# Altium schematic sheet REDLED.SchDoc
size A
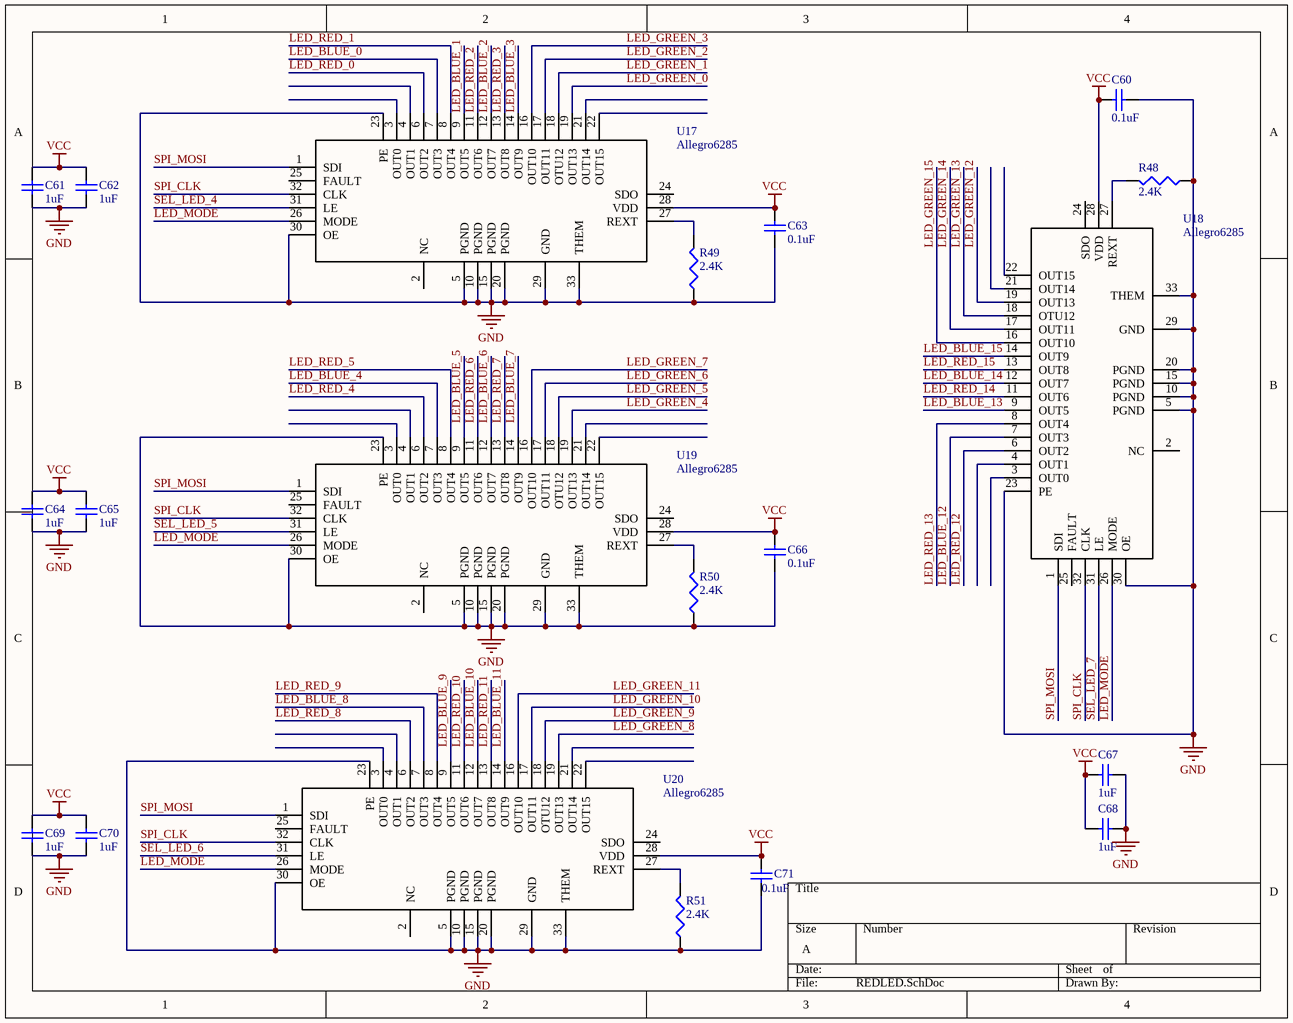
[diagram p0: REDLED.SchDoc]

## Parts
C60  value 0.1uF  [CAPC1005L]  (hidden comment: Cap Semi)
C61  value 1uF  [CAPC1608L]  (hidden comment: Cap Semi)
C62  value 1uF  [CAPC1608L]  (hidden comment: Cap Semi)
C63  value 0.1uF  [CAPC1005L]  (hidden comment: Cap Semi)
C64  value 1uF  [CAPC1608L]  (hidden comment: Cap Semi)
C65  value 1uF  [CAPC1608L]  (hidden comment: Cap Semi)
C66  value 0.1uF  [CAPC1005L]  (hidden comment: Cap Semi)
C67  value 1uF  [CAPC1608L]  (hidden comment: Cap Semi)
C68  value 1uF  [CAPC1608L]  (hidden comment: Cap Semi)
C69  value 1uF  [CAPC1608L]  (hidden comment: Cap Semi)
C70  value 1uF  [CAPC1608L]  (hidden comment: Cap Semi)
C71  value 0.1uF  [CAPC1005L]  (hidden comment: Cap Semi)
R48  value 2.4K  [RESC1608L]  (hidden comment: Res3)
R49  value 2.4K  [RESC1608L]  (hidden comment: Res3)
R50  value 2.4K  [RESC1608L]  (hidden comment: Res3)
R51  value 2.4K  [RESC1608L]  (hidden comment: Res3)
U17  Allegro6285  [QFN-32]
U18  Allegro6285  [QFN-32]
U19  Allegro6285  [QFN-32]
U20  Allegro6285  [QFN-32]

## Nets
GND: C60.1 C61.1 C62.1 C63.1 C64.1 C65.1 C66.1 C67.1 C68.1 C69.1 C70.1 C71.1 R48.1 R49.1 R50.1 R51.1 U17.5(PGND) U17.10(PGND) U17.15(PGND) U17.20(PGND) U17.23(PE) U17.29(GND) U17.30(OE) U17.33(THEM) U18.5(PGND) U18.10(PGND) U18.15(PGND) U18.20(PGND) U18.23(PE) U18.29(GND) U18.30(OE) U18.33(THEM) U19.5(PGND) U19.10(PGND) U19.15(PGND) U19.20(PGND) U19.23(PE) U19.29(GND) U19.30(OE) U19.33(THEM) U20.5(PGND) U20.10(PGND) U20.15(PGND) U20.20(PGND) U20.23(PE) U20.29(GND) U20.30(OE) U20.33(THEM)
VCC: C60.2 C61.2 C62.2 C63.2 C64.2 C65.2 C66.2 C67.2 C68.2 C69.2 C70.2 C71.2 U17.28(VDD) U18.28(VDD) U19.28(VDD) U20.28(VDD)
LED_BLUE_0: U17.7(OUT3)
LED_BLUE_1: U17.9(OUT5)
LED_BLUE_2: U17.12(OUT7)
LED_BLUE_3: U17.14(OUT9)
LED_BLUE_4: U19.7(OUT3)
LED_BLUE_5: U19.9(OUT5)
LED_BLUE_6: U19.12(OUT7)
LED_BLUE_7: U19.14(OUT9)
LED_BLUE_8: U20.7(OUT3)
LED_BLUE_9: U20.9(OUT5)
LED_BLUE_10: U20.12(OUT7)
LED_BLUE_11: U20.14(OUT9)
LED_BLUE_12: U18.7(OUT3)
LED_BLUE_13: U18.9(OUT5)
LED_BLUE_14: U18.12(OUT7)
LED_BLUE_15: U18.14(OUT9)
LED_GREEN_0: U17.19(OUT13)
LED_GREEN_1: U17.18(OTU12)
LED_GREEN_2: U17.17(OUT11)
LED_GREEN_3: U17.16(OUT10)
LED_GREEN_4: U19.19(OUT13)
LED_GREEN_5: U19.18(OTU12)
LED_GREEN_6: U19.17(OUT11)
LED_GREEN_7: U19.16(OUT10)
LED_GREEN_8: U20.19(OUT13)
LED_GREEN_9: U20.18(OTU12)
LED_GREEN_10: U20.17(OUT11)
LED_GREEN_11: U20.16(OUT10)
LED_GREEN_12: U18.19(OUT13)
LED_GREEN_13: U18.18(OTU12)
LED_GREEN_14: U18.17(OUT11)
LED_GREEN_15: U18.16(OUT10)
LED_MODE: U17.26(MODE) U18.26(MODE) U19.26(MODE) U20.26(MODE)
LED_RED_0: U17.6(OUT2)
LED_RED_1: U17.8(OUT4)
LED_RED_2: U17.11(OUT6)
LED_RED_3: U17.13(OUT8)
LED_RED_4: U19.6(OUT2)
LED_RED_5: U19.8(OUT4)
LED_RED_6: U19.11(OUT6)
LED_RED_7: U19.13(OUT8)
LED_RED_8: U20.6(OUT2)
LED_RED_9: U20.8(OUT4)
LED_RED_10: U20.11(OUT6)
LED_RED_11: U20.13(OUT8)
LED_RED_12: U18.6(OUT2)
LED_RED_13: U18.8(OUT4)
LED_RED_14: U18.11(OUT6)
LED_RED_15: U18.13(OUT8)
SEL_LED_4: U17.31(LE)
SEL_LED_5: U19.31(LE)
SEL_LED_6: U20.31(LE)
SEL_LED_7: U18.31(LE)
SPI_CLK: U17.32(CLK) U18.32(CLK) U19.32(CLK) U20.32(CLK)
SPI_MOSI: U17.1(SDI) U18.1(SDI) U19.1(SDI) U20.1(SDI)
NetR48_2: R48.2 U18.27(REXT)
NetR49_2: R49.2 U17.27(REXT)
NetR50_2: R50.2 U19.27(REXT)
NetR51_2: R51.2 U20.27(REXT)

Not connected (* = marked no-connect by the designer): U17 2(NC) 3(OUT0) 4(OUT1) 21(OUT14) 22(OUT15) 24(SDO) 25(FAULT); U18 2(NC) 3(OUT0) 4(OUT1) 21(OUT14) 22(OUT15) 24(SDO) 25(FAULT); U19 2(NC) 3(OUT0) 4(OUT1) 21(OUT14) 22(OUT15) 24(SDO) 25(FAULT); U20 2(NC) 3(OUT0) 4(OUT1) 21(OUT14) 22(OUT15) 24(SDO) 25(FAULT)

## Library data of the parts
C60-C71 = Cap Semi: Capacitor (Semiconductor SIM Model); Published: 8-Jun-2000; LatestRevisionDate: 29-May-2009; LatestRevisionNote: IPC-7351 Footprint Added.; PackageReference: C1206; Publisher: Altium Limited; PackageDescription: Chip Capacitor
R48-R51 = Res3: Resistor; Published: 8-Jun-2000; LatestRevisionDate: 29-May-2009; LatestRevisionNote: IPC-7351 Footprint Added.; PackageReference: J1-0603; Publisher: Altium Limited; PackageDescription: Chip Resistor